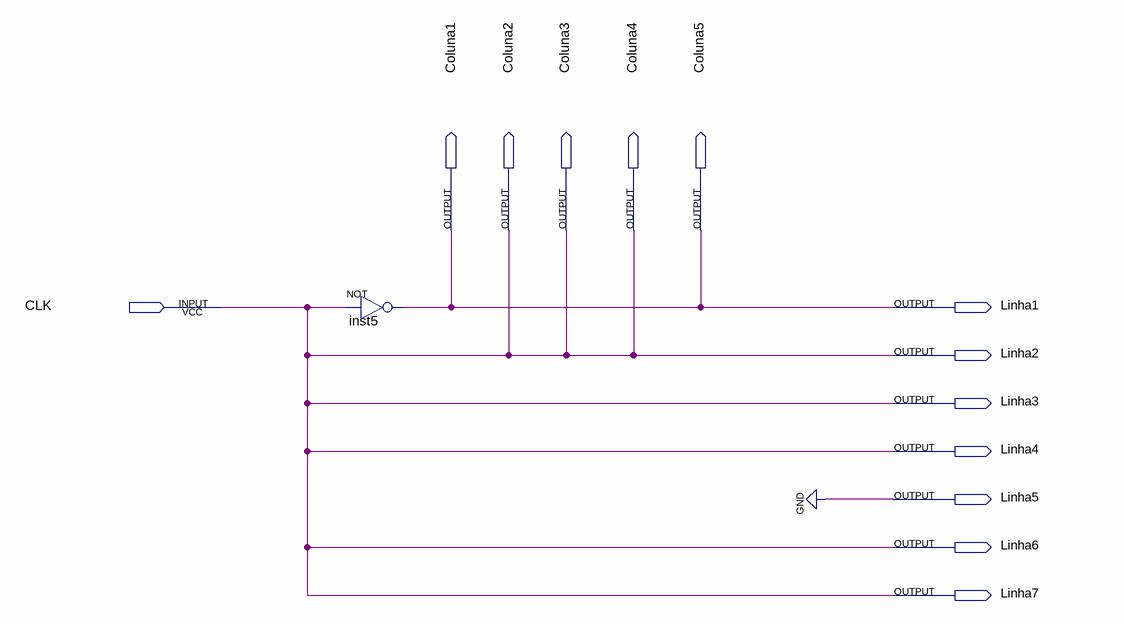
[diagram p0: schematic sheet]
// Quartus schematic LetraA.bdf as structural Verilog: 1 symbols, 13 pins
module LetraA (
  input  CLK,
  output Coluna1,
  output Coluna2,
  output Coluna3,
  output Coluna4,
  output Coluna5,
  output Linha1,
  output Linha2,
  output Linha3,
  output Linha4,
  output Linha5,
  output Linha6,
  output Linha7
);

  not inst5 (Coluna1, CLK);

  assign Coluna2 = CLK;
  assign Coluna3 = CLK;
  assign Coluna4 = CLK;
  assign Coluna5 = Coluna1;
  assign Linha1 = Coluna1;
  assign Linha2 = CLK;
  assign Linha3 = CLK;
  assign Linha4 = CLK;
  assign Linha5 = 1'b0;
  assign Linha6 = CLK;
  assign Linha7 = CLK;
endmodule
